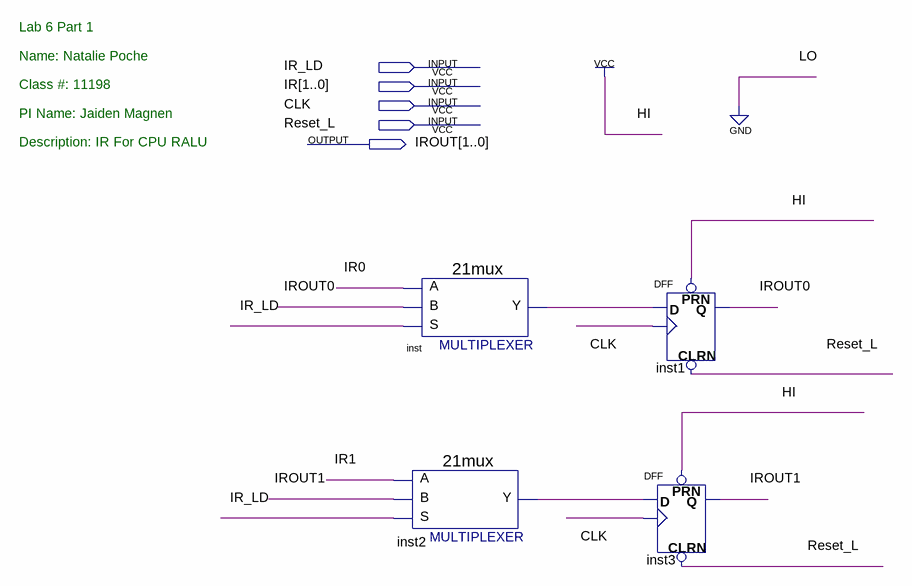
[diagram p0: schematic sheet]
// Quartus schematic IR.bdf as structural Verilog: 4 symbols, 5 pins
module IR (
  input  IR_LD,
  input  [1:0] IR,
  input  CLK,
  input  Reset_L,
  output [1:0] IROUT
);

  wire inst2_y, inst_y;

  \21mux  inst (.S(IR_LD), .B(IROUT[0]), .A(IR[0]), .Y(inst_y));
  \21mux  inst2 (.S(IR_LD), .B(IROUT[1]), .A(IR[1]), .Y(inst2_y));
  DFF inst1 (.CLRN(Reset_L), .CLK(CLK), .D(inst_y), .PRN(1'b1), .Q(IROUT[0]));
  DFF inst3 (.CLRN(Reset_L), .CLK(CLK), .D(inst2_y), .PRN(1'b1), .Q(IROUT[1]));

  // Notes on the sheet:
  //   Lab 6 Part 1
  //   Name: Natalie Poche
  //   Class #: 11198
  //   PI Name: Jaiden Magnen
  //   Description: IR For CPU RALU
endmodule
